# Altium project PEAK_PDB.PrjPcb
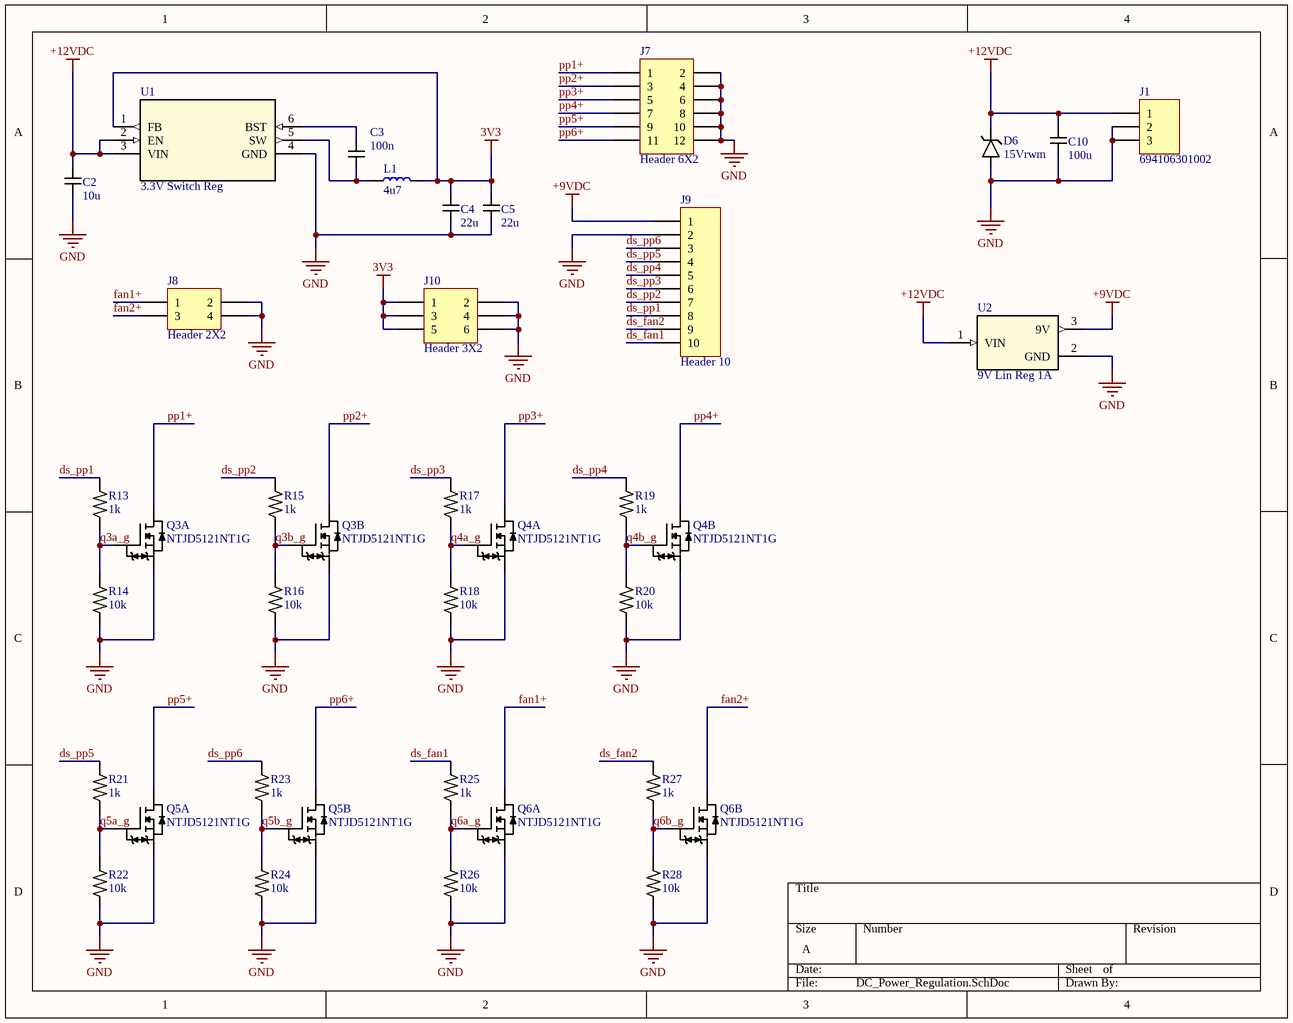
[diagram p0: DC_Power_Regulation.SchDoc]
2 sheets, 74 parts. Net scope: global (net labels, ports and power ports of the same name join across sheets).
Board file: PEAK_PDB.PcbDoc
Sheets:
  DC_Power_Regulation.SchDoc
  AC_Power_Management.SchDoc

## Sheet DC_Power_Regulation.SchDoc
size A; SheetNumber: 1; SheetTotal: 2

### Parts
C2  10u  [CAP_0805]
C3  100n  [CAP_0402]
C4  22u  [CAP_0805]
C5  22u  [CAP_0805]
C10  100u  [CAP_EEH-ZA1V151P_PAN]
D6  15Vrwm  [SOD523]
J1  694106301002  [694106301002]
J7  Header 6X2  [HDR2X6]
J8  Header 2X2  [HDR2X2]
J9  Header 10  [HDR1X10]
J10  Header 3X2  [HDR2X3]
L1  4u7  [IND_0603]
Q3  NTJD5121NT1G  [SOT-363]  (parts A,B of 2)
Q4  NTJD5121NT1G  [SOT-363]  (parts A,B of 2)
Q5  NTJD5121NT1G  [SOT-363]  (parts A,B of 2)
Q6  NTJD5121NT1G  [SOT-363]  (parts A,B of 2)
R13  1k  [RES_0402]
R14  10k  [RES_0402]
R15  1k  [RES_0402]
R16  10k  [RES_0402]
R17  1k  [RES_0402]
R18  10k  [RES_0402]
R19  1k  [RES_0402]
R20  10k  [RES_0402]
R21  1k  [RES_0402]
R22  10k  [RES_0402]
R23  1k  [RES_0402]
R24  10k  [RES_0402]
R25  1k  [RES_0402]
R26  10k  [RES_0402]
R27  1k  [RES_0402]
R28  10k  [RES_0402]
U1  3.3V Switch Reg  [AP63203WU-7]
U2  9V Lin Reg 1A  [MC7809CTG]

### Nets
3V3: C4.2 C5.2 J10.1 J10.3 J10.5 L1.2 U1.1(FB)
+9VDC: J9.1 U2.3(9V)
+12VDC: C2.2 C10.2 D6.1(V++) J1.1 U1.2(EN) U1.3(VIN) U2.1(VIN)
GND: C2.1 C4.1 C5.1 C10.1 D6.2(GND) J1.2 J1.3 J7.2 J7.4 J7.6 J7.8 J7.10 J7.12 J8.2 J8.4 J9.2 J10.2 J10.4 J10.6 Q3.3(S1) Q3.6(S2) Q4.3(S1) Q4.6(S2) Q5.3(S1) Q5.6(S2) Q6.3(S1) Q6.6(S2) R14.1 R16.1 R18.1 R20.1 R22.1 R24.1 R26.1 R28.1 U1.4(GND) U2.2(GND)
ds_fan1: J9.10 R25.1
ds_fan2: J9.9 R27.1
ds_pp1: J9.8 R13.1
ds_pp2: J9.7 R15.1
ds_pp3: J9.6 R17.1
ds_pp4: J9.5 R19.1
ds_pp5: J9.4 R21.1
ds_pp6: J9.3 R23.1
fan1+: J8.1 Q6.1(D1)
fan2+: J8.3 Q6.4(D2)
pp1+: J7.1 Q3.1(D1)
pp2+: J7.3 Q3.4(D2)
pp3+: J7.5 Q4.1(D1)
pp4+: J7.7 Q4.4(D2)
pp5+: J7.9 Q5.1(D1)
pp6+: J7.11 Q5.4(D2)
q3a_g: Q3.2(G1) R13.2 R14.2
q3b_g: Q3.5(G2) R15.2 R16.2
q4a_g: Q4.2(G1) R17.2 R18.2
q4b_g: Q4.5(G2) R19.2 R20.2
q5a_g: Q5.2(G1) R21.2 R22.2
q5b_g: Q5.5(G2) R23.2 R24.2
q6a_g: Q6.2(G1) R25.2 R26.2
q6b_g: Q6.5(G2) R27.2 R28.2
NetC3_1: C3.1 L1.1 U1.5(SW)
NetC3_2: C3.2 U1.6(BST)

### Library data of the parts
C2 C4 C5 = CAP_0805
C3 = CAP_0402
C10 = CAP_EEH-ZA1V151P_PAN
D6 = PESD15VS1UB,115: ESD protection (TVS) diode in SOD523 package
J1 = Header 3: Header, 3-Pin; LatestRevisionDate: 17-Jul-2002; LatestRevisionNote: Re-released for DXP Platform.; Publisher: Altium Limited
J7 = Header 6X2: Header, 6-Pin, Dual row; LatestRevisionDate: 17-Jul-2002; LatestRevisionNote: Re-released for DXP Platform.; Publisher: Altium Limited
J8 = Header 2X2: Header, 2-Pin, Dual row; LatestRevisionDate: 17-Jul-2002; LatestRevisionNote: Re-released for DXP Platform.; Publisher: Altium Limited
J9 = Header 10: Header, 10-Pin; LatestRevisionDate: 17-Jul-2002; LatestRevisionNote: Re-released for DXP Platform.; Publisher: Altium Limited
J10 = Header 3X2: Header, 3-Pin, Dual row; LatestRevisionDate: 17-Jul-2002; LatestRevisionNote: Re-released for DXP Platform.; Publisher: Altium Limited
L1 = IND_0603: Inductor SMD 0603
Q3-Q6 = NTJD5121NT1G: 2 NMOSFETs SOT-363
R13-R28 = RES_0402: Resistor SMD 0402 (0.0625W)
U1 = AP63203WU-7: IC REG BUCK 3.3V 2A TSOT23-6
U2 = MC7809CTG: IC REG LINEAR 9V 1A TO220AB

## Sheet AC_Power_Management.SchDoc
size A; SheetNumber: 2; SheetTotal: 2
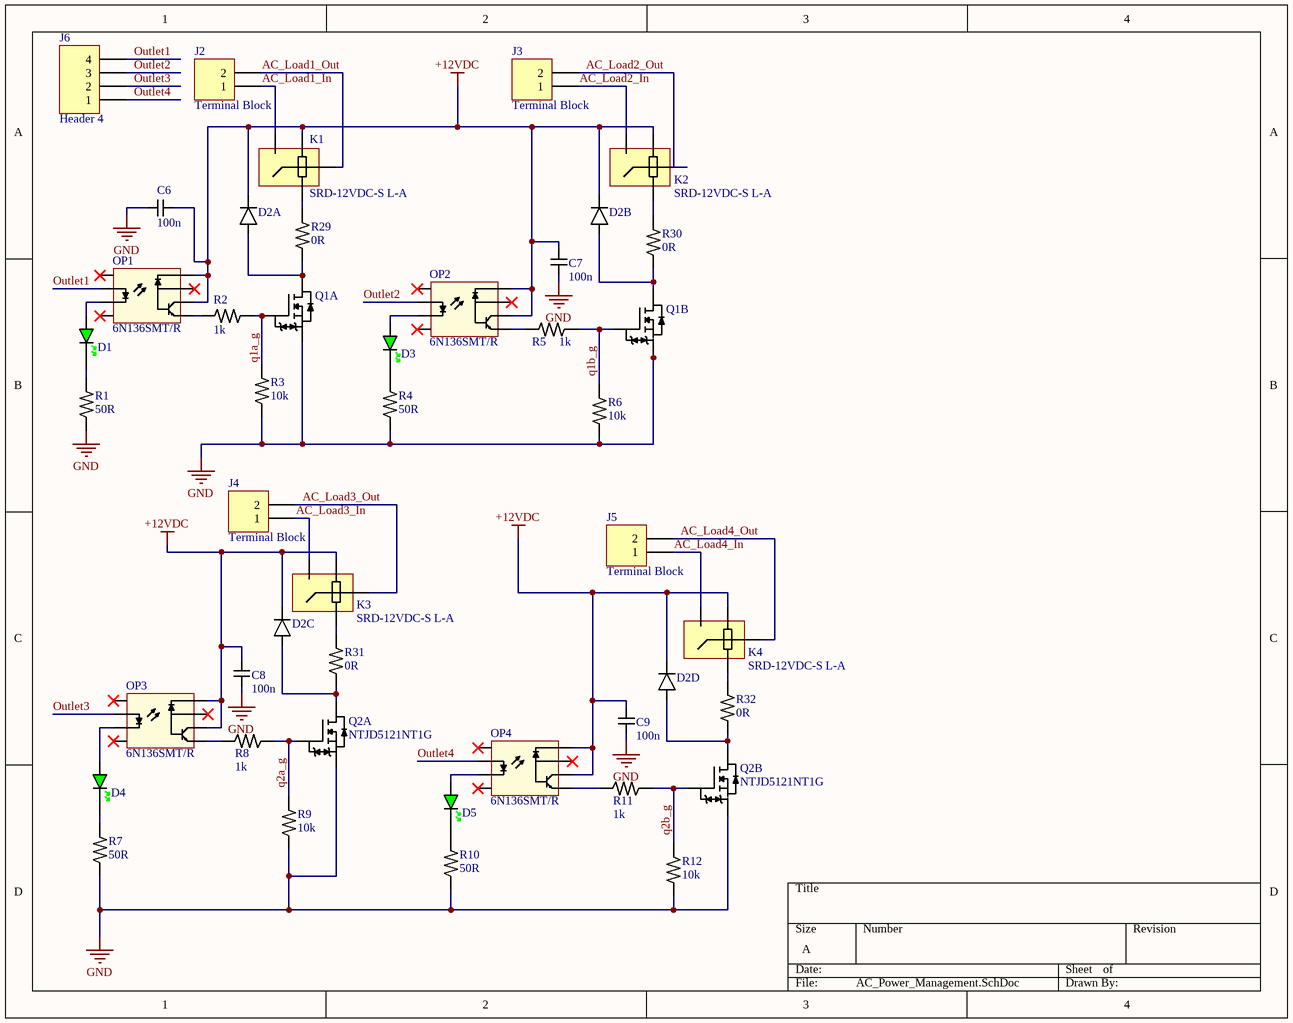
[diagram p1: AC_Power_Management.SchDoc]

### Parts
C6  100n  [CAP_0402]
C7  100n  [CAP_0402]
C8  100n  [CAP_0402]
C9  100n  [CAP_0402]
D1  GREEN  [LED_0805_GREEN]  (value not drawn)
D2  BAT54CDW-7-F  [SOT-363]  (value not drawn)  (parts A,B,C,D of 4)
D3  GREEN  [LED_0805_GREEN]  (value not drawn)
D4  GREEN  [LED_0805_GREEN]  (value not drawn)
D5  GREEN  [LED_0805_GREEN]  (value not drawn)
J2  Terminal Block  [25-E400-02]
J3  Terminal Block  [25-E400-02]
J4  Terminal Block  [25-E400-02]
J5  Terminal Block  [25-E400-02]
J6  Header 4  [HDR1X4]
K1  SRD-12VDC-S L-A  [SRD-12VDC-S L]
K2  SRD-12VDC-S L-A  [SRD-12VDC-S L]
K3  SRD-12VDC-S L-A  [SRD-12VDC-S L]
K4  SRD-12VDC-S L-A  [SRD-12VDC-S L]
OP1  6N136SMT/R  [SOP-8-2.54mm]
OP2  6N136SMT/R  [SOP-8-2.54mm]
OP3  6N136SMT/R  [SOP-8-2.54mm]
OP4  6N136SMT/R  [SOP-8-2.54mm]
Q1  NTJD5121NT1G  [SOT-363]  (value not drawn)  (parts A,B of 2)
Q2  NTJD5121NT1G  [SOT-363]  (parts A,B of 2)
R1  50R  [RES_0402]
R2  1k  [RES_0402]
R3  10k  [RES_0402]
R4  50R  [RES_0402]
R5  1k  [RES_0402]
R6  10k  [RES_0402]
R7  50R  [RES_0402]
R8  1k  [RES_0402]
R9  10k  [RES_0402]
R10  50R  [RES_0402]
R11  1k  [RES_0402]
R12  10k  [RES_0402]
R29  0R  [RES_0402]
R30  0R  [RES_0402]
R31  0R  [RES_0402]
R32  0R  [RES_0402]

### Nets
+12VDC: C6.1 C7.1 C8.1 C9.1 D2.1(C1) D2.4(C2) K1.4 K2.4 K3.4 K4.4 OP1.6(Vo) OP1.8(Vcc) OP2.6(Vo) OP2.8(Vcc) OP3.6(Vo) OP3.8(Vcc) OP4.6(Vo) OP4.8(Vcc)
GND: C6.2 C7.2 C8.2 C9.2 Q1.3(S1) Q1.6(S2) Q2.3(S1) Q2.6(S2) R1.1 R3.1 R4.1 R6.1 R7.1 R9.1 R10.1 R12.1
AC_Load1_In: J2.1 K1.1
AC_Load1_Out: J2.2 K1.3
AC_Load2_In: J3.1 K2.1
AC_Load2_Out: J3.2 K2.3
AC_Load3_In: J4.1 K3.1
AC_Load3_Out: J4.2 K3.3
AC_Load4_In: J5.1 K4.1
AC_Load4_Out: J5.2 K4.3
Outlet1: J6.4 OP1.2(A)
Outlet2: J6.3 OP2.2(A)
Outlet3: J6.2 OP3.2(A)
Outlet4: J6.1 OP4.2(A)
q1a_g: Q1.2(G1) R2.2 R3.2
q1b_g: Q1.5(G2) R5.2 R6.2
q2a_g: Q2.2(G1) R8.2 R9.2
q2b_g: Q2.5(G2) R11.2 R12.2
NetD1_A: D1.A OP1.3(C)
NetD1_K: D1.K R1.2
NetD2_2: D2.2(A2_1) Q2.1(D1) R31.1
NetD2_3: D2.3(A2_2) Q2.4(D2) R32.1
NetD2_5: D2.5(A1_1) Q1.1(D1) R29.1
NetD2_6: D2.6(A1_2) Q1.4(D2) R30.1
NetD3_A: D3.A OP2.3(C)
NetD3_K: D3.K R4.2
NetD4_A: D4.A OP3.3(C)
NetD4_K: D4.K R7.2
NetD5_A: D5.A OP4.3(C)
NetD5_K: D5.K R10.2
NetK1_2: K1.2 R29.2
NetK2_2: K2.2 R30.2
NetK3_2: K3.2 R31.2
NetK4_2: K4.2 R32.2
NetOP1_5: OP1.5(GND) R2.1
NetOP2_5: OP2.5(GND) R5.1
NetOP3_5: OP3.5(GND) R8.1
NetOP4_5: OP4.5(GND) R11.1

Not connected (* = marked no-connect by the designer): OP1 1(NC)* 4(NC)* 7(Vb)*; OP2 1(NC)* 4(NC)* 7(Vb)*; OP3 1(NC)* 4(NC)* 7(Vb)*; OP4 1(NC)* 4(NC)* 7(Vb)*

### Library data of the parts
C6-C9 = CAP_0402
D1 D3-D5 = LED_0805_GREEN: LED 0805 GREEN SMD; Manufacturer: *; Manufacturer Part Number: *; Distributor Link: *; LCSC: *
D2 = BAT54CDW-7-F: 2 Pairs of Common Cathode Diodes in SOT363 Package BAT54CDW-7-F
J2-J5 = Header 2: Header, 2-Pin; LatestRevisionDate: 17-Jul-2002; LatestRevisionNote: Re-released for DXP Platform.; Publisher: Altium Limited
J6 = Header 4: Header, 4-Pin; LatestRevisionDate: 17-Jul-2002; LatestRevisionNote: Re-released for DXP Platform.; Publisher: Altium Limited
OP1-OP4 = 6N136SMT/R: Optocouplers SMD-8 RoHS. SOP-8-2.54mm Package
Q1 Q2 = NTJD5121NT1G: 2 NMOSFETs SOT-363
R1-R12 R29-R32 = RES_0402: Resistor SMD 0402 (0.0625W)

## Nets that join several sheets
+12VDC: DC_Power_Regulation (7 pins), AC_Power_Management (18 pins)
GND: DC_Power_Regulation (37 pins), AC_Power_Management (16 pins)